# Altium schematic sheet 16-BitSWStatusLed.SchDoc
size A4; DocumentNumber: 16; SheetNumber: 16; SheetTotal: 26
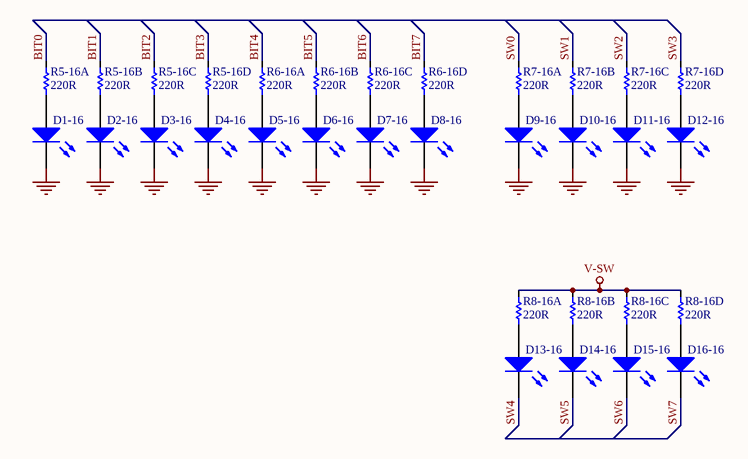
[diagram p0: 16-BitSWStatusLed.SchDoc]

## Parts
D1-16  LED  [LED-0805]  (value not drawn)
D2-16  LED  [LED-0805]  (value not drawn)
D3-16  LED  [LED-0805]  (value not drawn)
D4-16  LED  [LED-0805]  (value not drawn)
D5-16  LED  [LED-0805]  (value not drawn)
D6-16  LED  [LED-0805]  (value not drawn)
D7-16  LED  [LED-0805]  (value not drawn)
D8-16  LED  [LED-0805]  (value not drawn)
D9-16  LED  [LED-0805]  (value not drawn)
D10-16  LED  [LED-0805]  (value not drawn)
D11-16  LED  [LED-0805]  (value not drawn)
D12-16  LED  [LED-0805]  (value not drawn)
D13-16  LED  [LED-0805]  (value not drawn)
D14-16  LED  [LED-0805]  (value not drawn)
D15-16  LED  [LED-0805]  (value not drawn)
D16-16  LED  [LED-0805]  (value not drawn)
R5-16  220R  [R-Array-0603-4]  (parts A,B,C,D of 4)
R6-16  220R  [R-Array-0603-4]  (parts A,B,C,D of 4)
R7-16  220R  [R-Array-0603-4]  (parts A,B,C,D of 4)
R8-16  220R  [R-Array-0603-4]  (parts A,B,C,D of 4)

## Nets
GND: D1-16.2(K) D2-16.2(K) D3-16.2(K) D4-16.2(K) D5-16.2(K) D6-16.2(K) D7-16.2(K) D8-16.2(K) D9-16.2(K) D10-16.2(K) D11-16.2(K) D12-16.2(K)
V-SW: R8-16.2 R8-16.4 R8-16.6 R8-16.8
BIT0: R5-16.2
BIT1: R5-16.4
BIT2: R5-16.6
BIT3: R5-16.8
BIT4: R6-16.2
BIT5: R6-16.4
BIT6: R6-16.6
BIT7: R6-16.8
SW0: R7-16.2
SW1: R7-16.4
SW2: R7-16.6
SW3: R7-16.8
SW4: D13-16.2(K)
SW5: D14-16.2(K)
SW6: D15-16.2(K)
SW7: D16-16.2(K)
NetD1-16_1: D1-16.1(A) R5-16.1
NetD2-16_1: D2-16.1(A) R5-16.3
NetD3-16_1: D3-16.1(A) R5-16.5
NetD4-16_1: D4-16.1(A) R5-16.7
NetD5-16_1: D5-16.1(A) R6-16.1
NetD6-16_1: D6-16.1(A) R6-16.3
NetD7-16_1: D7-16.1(A) R6-16.5
NetD8-16_1: D8-16.1(A) R6-16.7
NetD9-16_1: D9-16.1(A) R7-16.1
NetD10-16_1: D10-16.1(A) R7-16.3
NetD11-16_1: D11-16.1(A) R7-16.5
NetD12-16_1: D12-16.1(A) R7-16.7
NetD13-16_1: D13-16.1(A) R8-16.1
NetD14-16_1: D14-16.1(A) R8-16.3
NetD15-16_1: D15-16.1(A) R8-16.5
NetD16-16_1: D16-16.1(A) R8-16.7

## Library data of the parts
D1-16 D2-16 D3-16 D4-16 D5-16 D6-16 D7-16 D8-16 D9-16 D10-16 D11-16 D12-16 D13-16 D14-16 D15-16 D16-16 = LED2: Typical RED, GREEN, YELLOW, AMBER GaAs LED; Published: 8-Jun-2000; LatestRevisionDate: 17-Jul-2002; LatestRevisionNote: Re-released for DXP Platform.; PackageVersion: Feb-2002; PackageReference: 3.2X1.6X1.1; Publisher: Altium Limited; PackageDescription: SM LED; 2 Flat Leads
R5-16 R6-16 R7-16 R8-16 = R-8P4R: RES ARRAY 4 RES 330 OHM 1206; Manufacturer: Panasonic Electronic Components; Manufacturer Part Number: EXB-38V331JV; Digi-Key Part Number: Y9331TR-ND; Link: http://www.digikey.com/product-detail/en/EXB-38V331JV/Y9331TR-ND/256525; Value: 220R